# Altium schematic sheet Sense.SchDoc: Sense
size Letter; DrawnBy: Qinyang Bao, Kyle Hong; Organization: UW Robotics; Address1: 200 University Avenue; Address2: Waterloo; Address3: Ontario; Address4: Canada N2L 3G6
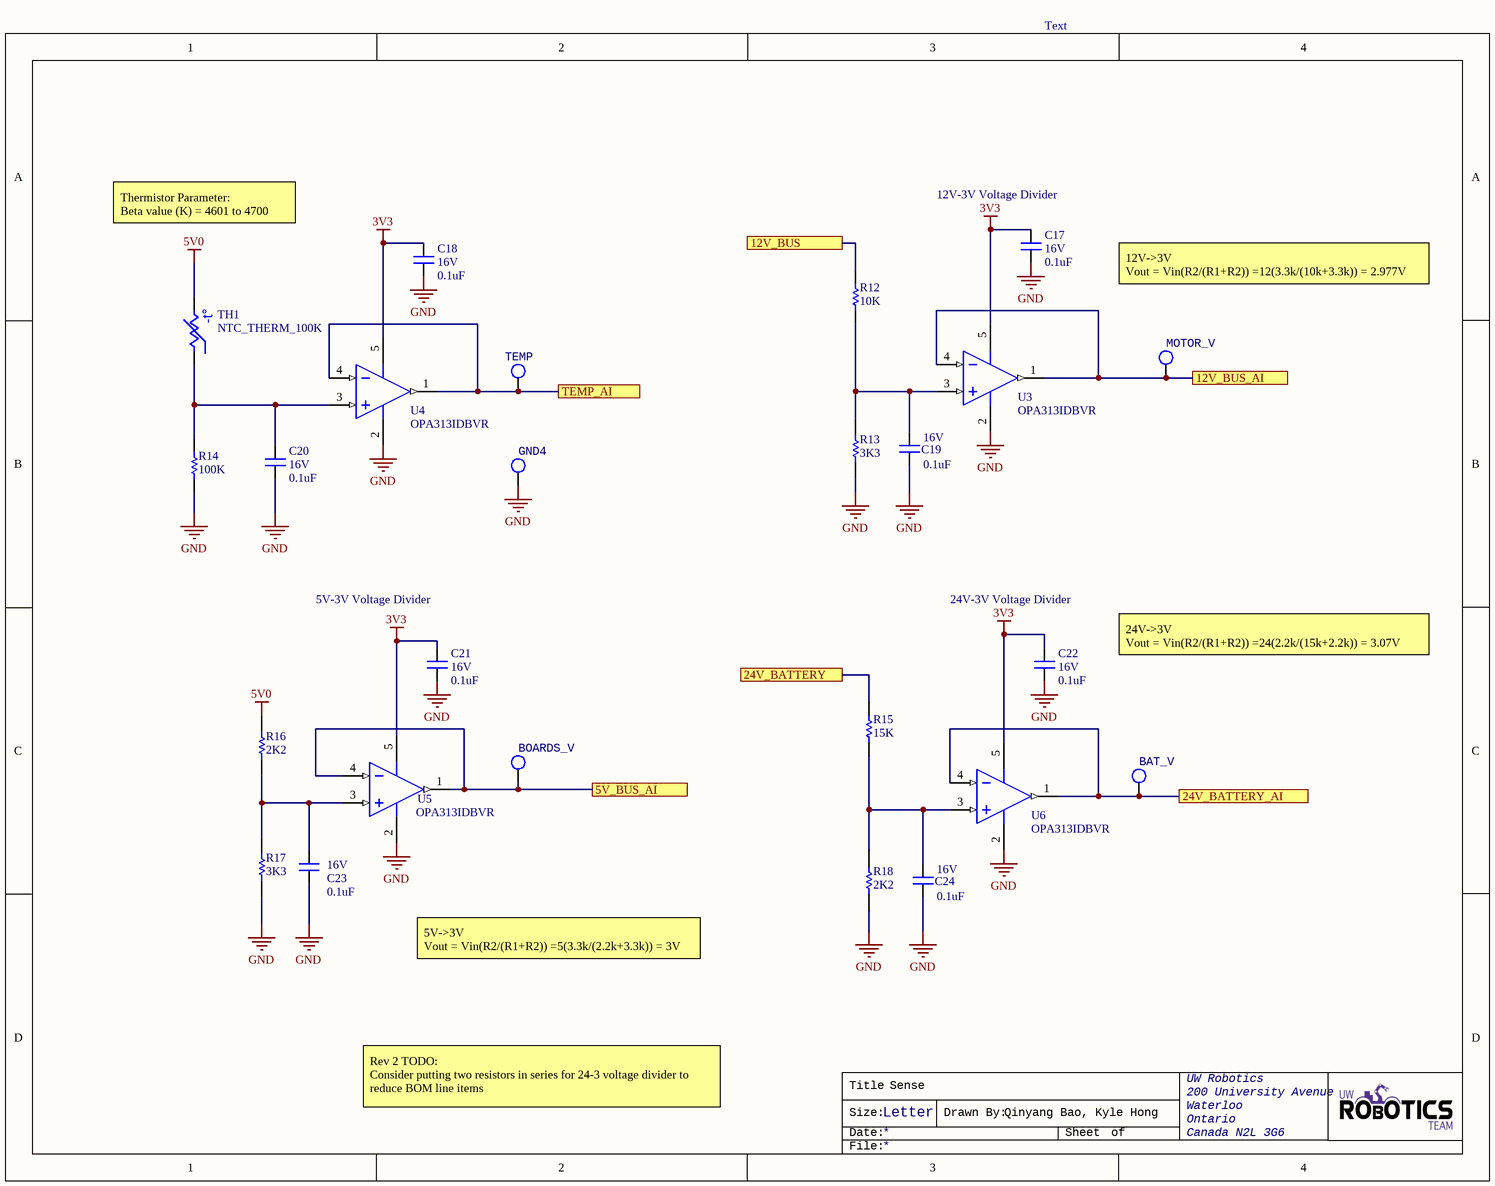
[diagram p0: Sense.SchDoc]

## Parts
BAT_V  TESTPOINT_LOOP  [TESTPOINT_LOOP]  (value not drawn)
BOARDS_V  TESTPOINT_LOOP  [TESTPOINT_LOOP]  (value not drawn)
C17  value 0.1uF  Voltage Rating: 16V  [CAPC0603(1608)55_N]  (hidden comment: CAP_0.1uF_16V_0603)
C18  value 0.1uF  Voltage Rating: 16V  [CAPC0603(1608)55_N]  (hidden comment: CAP_0.1uF_16V_0603)
C19  value 0.1uF  Voltage Rating: 16V  [CAPC0603(1608)55_N]  (hidden comment: CAP_0.1uF_16V_0603)
C20  value 0.1uF  Voltage Rating: 16V  [CAPC0603(1608)55_N]  (hidden comment: CAP_0.1uF_16V_0603)
C21  value 0.1uF  Voltage Rating: 16V  [CAPC0603(1608)55_N]  (hidden comment: CAP_0.1uF_16V_0603)
C22  value 0.1uF  Voltage Rating: 16V  [CAPC0603(1608)55_N]  (hidden comment: CAP_0.1uF_16V_0603)
C23  value 0.1uF  Voltage Rating: 16V  [CAPC0603(1608)55_N]  (hidden comment: CAP_0.1uF_16V_0603)
C24  value 0.1uF  Voltage Rating: 16V  [CAPC0603(1608)55_N]  (hidden comment: CAP_0.1uF_16V_0603)
GND4  TESTPOINT_LOOP  [TESTPOINT_LOOP]  (value not drawn)
MOTOR_V  TESTPOINT_LOOP  [TESTPOINT_LOOP]  (value not drawn)
R12  value 10K  [RESC0603(1608)_N]  (hidden comment: RES_10K_0603)
R13  value 3K3  [RESC0603(1608)_N]  (hidden comment: RES_3K3_0603)
R14  value 100K  [RESC0603(1608)_N]  (hidden comment: RES_100K_0603)
R15  value 15K  [RESC0603(1608)_N]  (hidden comment: RES_15K_0603)
R16  value 2K2  [RESC0603(1608)_N]  (hidden comment: RES_2K2_0603)
R17  value 3K3  [RESC0603(1608)_N]  (hidden comment: RES_3K3_0603)
R18  value 2K2  [RESC0603(1608)_N]  (hidden comment: RES_2K2_0603)
TEMP  TESTPOINT_LOOP  [TESTPOINT_LOOP]  (value not drawn)
TH1  NTC_THERM_100K  [RESC0603(1608)_N]
U3  OPA313IDBVR  [DBV0005A_M]
U4  OPA313IDBVR  [DBV0005A_M]
U5  OPA313IDBVR  [DBV0005A_M]
U6  OPA313IDBVR  [DBV0005A_M]

## Ports
5V_BUS_AI, 12V_BUS, 12V_BUS_AI, 24V_BATTERY, 24V_BATTERY_AI, TEMP_AI

## Nets
3V3: C17.2 C18.1 C21.2 C22.2 U3.5(V+) U4.5(V+) U5.5(V+) U6.5(V+)
5V0: R16.2 TH1.1
GND: C17.1 C18.2 C19.1 C20.1 C21.1 C22.1 C23.1 C24.1 GND4.1 R13.1 R14.1 R17.1 R18.1 U3.2(V-) U4.2(V-) U5.2(V-) U6.2(V-)
5V_BUS_AI: BOARDS_V.1 U5.1(OUT) U5.4(IN-) ; port 5V_BUS_AI
12V_BUS: R12.2 ; port 12V_BUS
12V_BUS_AI: MOTOR_V.1 U3.1(OUT) U3.4(IN-) ; port 12V_BUS_AI
24V_BATTERY: R15.2 ; port 24V_BATTERY
24V_BATTERY_AI: BAT_V.1 U6.1(OUT) U6.4(IN-) ; port 24V_BATTERY_AI
TEMP_AI: TEMP.1 U4.1(OUT) U4.4(IN-) ; port TEMP_AI
NetC19_2: C19.2 R12.1 R13.2 U3.3(IN+)
NetC20_2: C20.2 R14.2 TH1.2 U4.3(IN+)
NetC23_2: C23.2 R16.1 R17.2 U5.3(IN+)
NetC24_2: C24.2 R15.1 R18.2 U6.3(IN+)

## Notes on the sheet
- Text
- Thermistor Parameter:
  Beta value (K) = 4601 to 4700
- (near C17) 12V-3V Voltage Divider
- 12V->3V
  Vout = Vin(R2/(R1+R2)) =12(3.3k/(10k+3.3k)) = 2.977V
- 5V-3V Voltage Divider
- 24V-3V Voltage Divider
- 24V->3V
  Vout = Vin(R2/(R1+R2)) =24(2.2k/(15k+2.2k)) = 3.07V
- 5V->3V
  Vout = Vin(R2/(R1+R2)) =5(3.3k/(2.2k+3.3k)) = 3V
- Rev 2 TODO:
  Consider putting two resistors in series for 24-3 voltage divider to reduce BOM line items
- Title
- Size:
- Date:
- Letter
- Drawn By:
- Sheet
- of
- File:
- (in symbol NTC_THERM_100K) -t°

## Library data of the parts
BAT_V BOARDS_V GND4 MOTOR_V TEMP = TESTPOINT_LOOP: Loop testpoint through-hole pad; Manufacturer: Keystone Electronics; Manufacturer Part Number 1: 5002; Supplier Part Number 1: 36-5002-ND; Supplier 1: Digi-Key
C17-C24 = CAP_0.1uF_16V_0603: CAP CER 0.1UF 16V X7R 0603; MPN: CC0603KRX7R7BB104; Manufacturer: Yageo; Dimensions: 0.063" L x 0.031" W (1.60mm x 0.80mm); Package: 0603 (1608 Metric); Temperature Coefficient: X7R; Supplier Part Number 1: 311-1088-1-ND; Supplier 1: Digi-Key
R12 = RES_10K_0603: RES SMD 10K OHM 5% 1/10W 0603; Manufacturer: Yageo; MPN: RC0603JR-0710KL; Dimensions: 0.063" L x 0.031" W (1.60mm x 0.80mm); Tolerance: 5%; Package: 0603 (1608 Metric); Supplier Part Number 1: 311-10KGRCT-ND; Supplier 1: Digi-Key
R13 R17 = RES_3K3_0603: RES SMD 3.3K OHM 5% 1/10W 0603; Manufacturer: Yageo; MPN: RC0603JR-073K3L; Dimensions: 0.063" L x 0.031" W (1.60mm x 0.80mm); Tolerance: 5%; Package: 0603 (1608 Metric); Supplier Part Number 1: 311-3.3KGRCT-ND; Supplier 1: Digi-Key; Digikey Part Number: 311-3.3KGRCT-ND
R14 = RES_100K_0603: RES SMD 100K OHM 5% 1/10W 0603; Manufacturer: Yageo; MPN: RC0603FR-07261KL; Dimensions: 0.063" L x 0.031" W (1.60mm x 0.80mm); Tolerance: 5%; Package: 0603 (1608 Metric); Supplier Part Number 1: 311-261KHRCT-ND; Supplier 1: Digi-Key
R15 = RES_15K_0603: RES SMD 15K OHM 5% 1/10W 0603; Manufacturer 1: Yageo; Manufacturer Part Number 1: RC0603JR-0715KL; Dimensions: 0.063" L x 0.031" W (1.60mm x 0.80mm); Tolerance: 5%; Package: 0603 (1608 Metric); Supplier Part Number 1: 311-15KGRCT-ND; Supplier 1: Digi-Key
R16 R18 = RES_2K2_0603: RES SMD 2.2K OHM 1% 1/10W 0603; Manufacturer: Yageo; MPN: RC0603FR-072K2L; Dimensions: 0.063" L x 0.031" W (1.60mm x 0.80mm); Tolerance: 1%; Package: 0603 (1608 Metric); Supplier Part Number 1: 311-2.20KHRCT-ND; Supplier 1: Digi-Key
TH1 = NTC_THERM_100K: THERM NTC 100KOHM 4700K 0603; MPN: ERT-J1VV104J; Manufacturer: Panasonic; Value: 100K; Supplier Part Number 1: P10555CT-ND; Supplier 1: Digi-Key
U3-U6 = OPAMP: IC OPAMP GP 1 CIRCUIT SOT23-5; Manufacturer: Texas Instruments; Offset Drift(Typ)(uV/C): 2; Rating: Catalog; Packing: LARGE T&R; SubFamily: Low Input Bias Current Amp (<=10pA), Low Power Amp (<=500uA); Number of Channels: 1; Eco-Plan: Green (RoHS & no Sb/Br); Vio (25C)(Max)(mV): 2.5; Total Supply Voltage(Min)(+5V is 5, +/-5V is 10): 1.8; CMRR(Min)(dB): 70; Total Supply Voltage(Max)(+5V is 5, +/-5V is 10): 5.5; Iq per channel(Max)(mA): 0.06; Slew Rate(Typ)(V/us): 0.5; ComponentLink1Description: Manufacturer URL; PackageVersion: 4073253-4/K, 03/2006; ComponentLink2Description: Datasheet; Code_JEDEC: MO-178; GBW(Typ)(MHz): 1; ComponentLink3Description: Package Specification; PartNumber: OPA313IDBVR; PackageReference: DBV0005A; Mounting Technology: Surface Mount; PackageDescription: 5-Pin Plastic Small Outline, Body 1.6 x 2.9 mm, Pitch 0.95 mm; ComponentLink1URL: http://www.ti.com/; DatasheetVersion: SBOS649C; ComponentLink2URL: http://www.ti.com/lit/ds/symlink/opa313.pdf; ComponentLink3URL: http://www.ti.com/litv/pdf/mpds018i; Supplier Part Number 1: 296-35607-1-ND; Supplier 1: Digi-Key